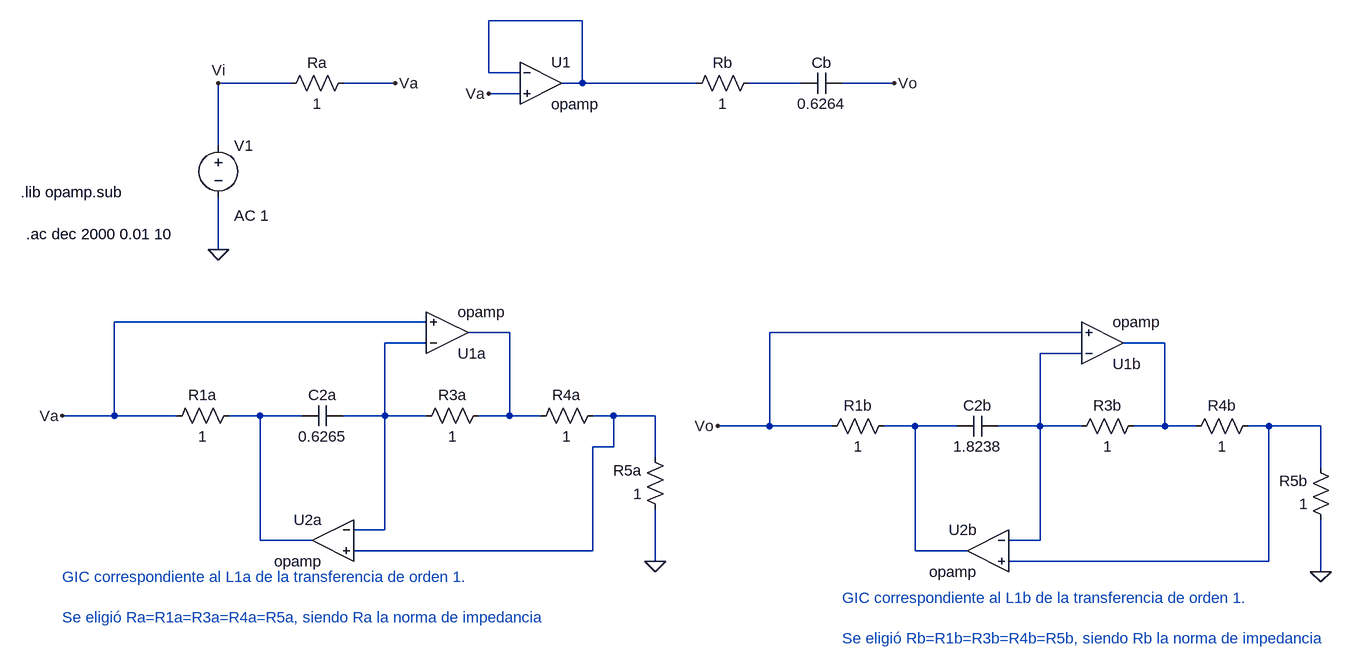
[diagram p0: schematic con_GICS.asc]
con_GICS.asc, the LTspice schematic file:
Version 4.1
SHEET 1 1560 1024
WIRE 352 64 208 64
WIRE 208 144 208 64
WIRE 256 144 208 144
WIRE -96 160 -208 160
WIRE 64 160 -16 160
WIRE 352 160 352 64
WIRE 352 160 320 160
WIRE 528 160 352 160
WIRE 688 160 608 160
WIRE 832 160 752 160
WIRE 256 176 208 176
WIRE -208 256 -208 160
WIRE -208 416 -208 336
WIRE 112 528 -368 528
WIRE 240 544 176 544
WIRE 1120 544 640 544
WIRE 112 560 48 560
WIRE 1248 560 1184 560
WIRE 1120 576 1056 576
WIRE -368 672 -368 528
WIRE -368 672 -448 672
WIRE -272 672 -368 672
WIRE -144 672 -192 672
WIRE -80 672 -144 672
WIRE 48 672 48 560
WIRE 48 672 -16 672
WIRE 112 672 48 672
WIRE 240 672 240 544
WIRE 240 672 192 672
WIRE 288 672 240 672
WIRE 400 672 368 672
WIRE 464 672 400 672
WIRE 640 688 640 544
WIRE 640 688 560 688
WIRE 736 688 640 688
WIRE 864 688 816 688
WIRE 928 688 864 688
WIRE 1056 688 1056 576
WIRE 1056 688 992 688
WIRE 1120 688 1056 688
WIRE 1248 688 1248 560
WIRE 1248 688 1200 688
WIRE 1296 688 1248 688
WIRE 1408 688 1376 688
WIRE 1488 688 1408 688
WIRE 400 720 400 672
WIRE 400 720 368 720
WIRE 464 736 464 672
WIRE 1488 752 1488 688
WIRE 48 848 48 672
WIRE 48 848 0 848
WIRE -144 864 -144 672
WIRE -64 864 -144 864
WIRE 1056 864 1056 688
WIRE 1056 864 1008 864
WIRE 368 880 368 720
WIRE 368 880 0 880
WIRE 864 880 864 688
WIRE 944 880 864 880
WIRE 464 896 464 816
WIRE 1408 896 1408 688
WIRE 1408 896 1008 896
WIRE 1488 912 1488 832
FLAG -208 416 0
FLAG -208 160 Vi
FLAG 64 160 Va
FLAG 208 176 Va
FLAG -448 672 Va
FLAG 464 896 0
FLAG 1488 912 0
FLAG 832 160 Vo
FLAG 560 688 Vo
SYMBOL res 0 144 R90
WINDOW 0 0 56 VBottom 2
WINDOW 3 32 56 VTop 2
SYMATTR InstName Ra
SYMATTR Value 1
SYMBOL res 624 144 R90
WINDOW 0 0 56 VBottom 2
WINDOW 3 32 56 VTop 2
SYMATTR InstName Rb
SYMATTR Value 1
SYMBOL cap 752 144 R90
WINDOW 0 0 32 VBottom 2
WINDOW 3 32 32 VTop 2
SYMATTR InstName Cb
SYMATTR Value 0.6264
SYMBOL OpAmps\\opamp 288 96 R0
SYMATTR InstName U1
SYMBOL voltage -208 240 R0
WINDOW 123 24 124 Left 2
WINDOW 39 0 0 Left 0
SYMATTR InstName V1
SYMATTR Value ""
SYMATTR Value2 AC 1
SYMBOL res -176 656 R90
WINDOW 0 0 56 VBottom 2
WINDOW 3 32 56 VTop 2
SYMATTR InstName R1a
SYMATTR Value 1
SYMBOL res 208 656 R90
WINDOW 0 0 56 VBottom 2
WINDOW 3 32 56 VTop 2
SYMATTR InstName R3a
SYMATTR Value 1
SYMBOL res 384 656 R90
WINDOW 0 0 56 VBottom 2
WINDOW 3 32 56 VTop 2
SYMATTR InstName R4a
SYMATTR Value 1
SYMBOL res 480 832 R180
WINDOW 0 36 76 Left 2
WINDOW 3 36 40 Left 2
SYMATTR InstName R5a
SYMATTR Value 1
SYMBOL cap -16 656 R90
WINDOW 0 0 32 VBottom 2
WINDOW 3 32 32 VTop 2
SYMATTR InstName C2a
SYMATTR Value 0.6265
SYMBOL OpAmps\\opamp 144 608 M180
SYMATTR InstName U1a
SYMBOL OpAmps\\opamp -32 800 M0
SYMATTR InstName U2a
SYMBOL res 832 672 R90
WINDOW 0 0 56 VBottom 2
WINDOW 3 32 56 VTop 2
SYMATTR InstName R1b
SYMATTR Value 1
SYMBOL res 1216 672 R90
WINDOW 0 0 56 VBottom 2
WINDOW 3 32 56 VTop 2
SYMATTR InstName R3b
SYMATTR Value 1
SYMBOL res 1392 672 R90
WINDOW 0 0 56 VBottom 2
WINDOW 3 32 56 VTop 2
SYMATTR InstName R4b
SYMATTR Value 1
SYMBOL res 1504 848 R180
WINDOW 0 36 76 Left 2
WINDOW 3 36 40 Left 2
SYMATTR InstName R5b
SYMATTR Value 1
SYMBOL cap 992 672 R90
WINDOW 0 0 32 VBottom 2
WINDOW 3 32 32 VTop 2
SYMATTR InstName C2b
SYMATTR Value 1.8238
SYMBOL OpAmps\\opamp 1152 624 M180
SYMATTR InstName U1b
SYMBOL OpAmps\\opamp 976 816 M0
SYMATTR InstName U2b
TEXT -448 920 Left 2 ;GIC correspondiente al L1a de la transferencia de orden 1.\n \nSe eligió Ra=R1a=R3a=R4a=R5a, siendo Ra la norma de impedancia
TEXT 752 952 Left 2 ;GIC correspondiente al L1b de la transferencia de orden 1.\n \nSe eligió Rb=R1b=R3b=R4b=R5b, siendo Rb la norma de impedancia
TEXT -512 328 Left 2 !.lib opamp.sub
TEXT -504 392 Left 2 !.ac dec 2000 0.01 10

The netlist it stands for:
* con_GICS.asc
Ra Va Vi 1
Rb N002 N001 1
Cb Vo N002 0.6264
X§U1 N001 Va N001 opamp Aol=100K GBW=10Meg  ; pins invin noninvin out
V1 Vi 0 AC 1
R1a N007 Va 1
R3a N003 N004 1
R4a N008 N003 1
R5a 0 N008 1
C2a N004 N007 0.6265
X§U1a N004 Va N003 opamp Aol=100K GBW=10Meg  ; pins invin noninvin out
X§U2a N004 N008 N007 opamp Aol=100K GBW=10Meg  ; pins invin noninvin out
R1b N009 Vo 1
R3b N005 N006 1
R4b N010 N005 1
R5b 0 N010 1
C2b N006 N009 1.8238
X§U1b N006 Vo N005 opamp Aol=100K GBW=10Meg  ; pins invin noninvin out
X§U2b N006 N010 N009 opamp Aol=100K GBW=10Meg  ; pins invin noninvin out
* GIC correspondiente al L1a de la transferencia de orden 1.
* Se eligió Ra=R1a=R3a=R4a=R5a, siendo Ra la norma de impedancia
* GIC correspondiente al L1b de la transferencia de orden 1.
* Se eligió Rb=R1b=R3b=R4b=R5b, siendo Rb la norma de impedancia
.lib opamp.sub
.ac dec 2000 0.01 10
.backanno
.end

* Results of the author's LTspice run, read from the files saved beside the schematic
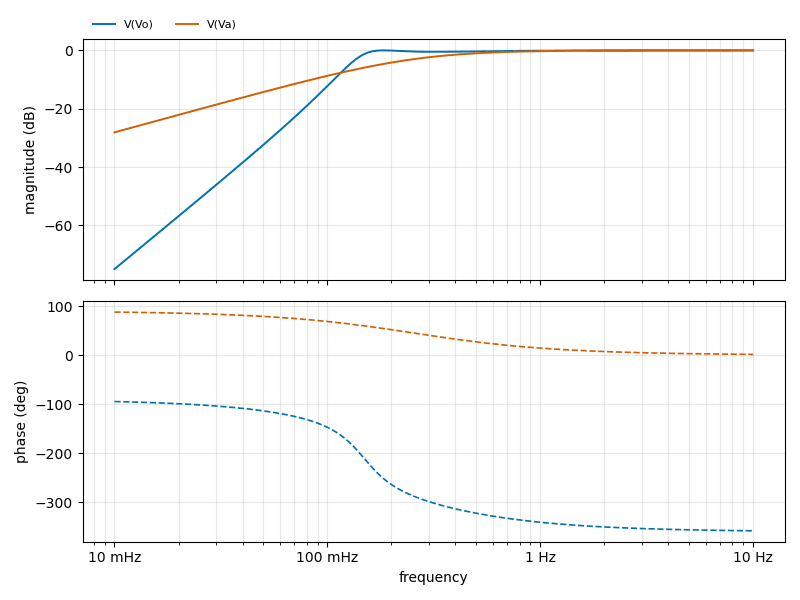
[diagram p1: AC Analysis of con_GICS.asc, plotted from the saved traces]
* AC Analysis, 1 run:
*   V(Vo): -74.99 dB at 10 mHz, -0.00 dB at 10 Hz, peak -0.00 dB at 183.9 mHz, 3 dB below the peak at 136.3 mHz
*   V(Va): -28.10 dB at 10 mHz, -0.00 dB at 10 Hz, peak -0.00 dB at 10 Hz, 3 dB below the peak at 253.9 mHz